# Altium schematic sheet BLOCK DIAGRAM.SchDoc
size A4; SheetNumber: 2; SheetTotal: 5
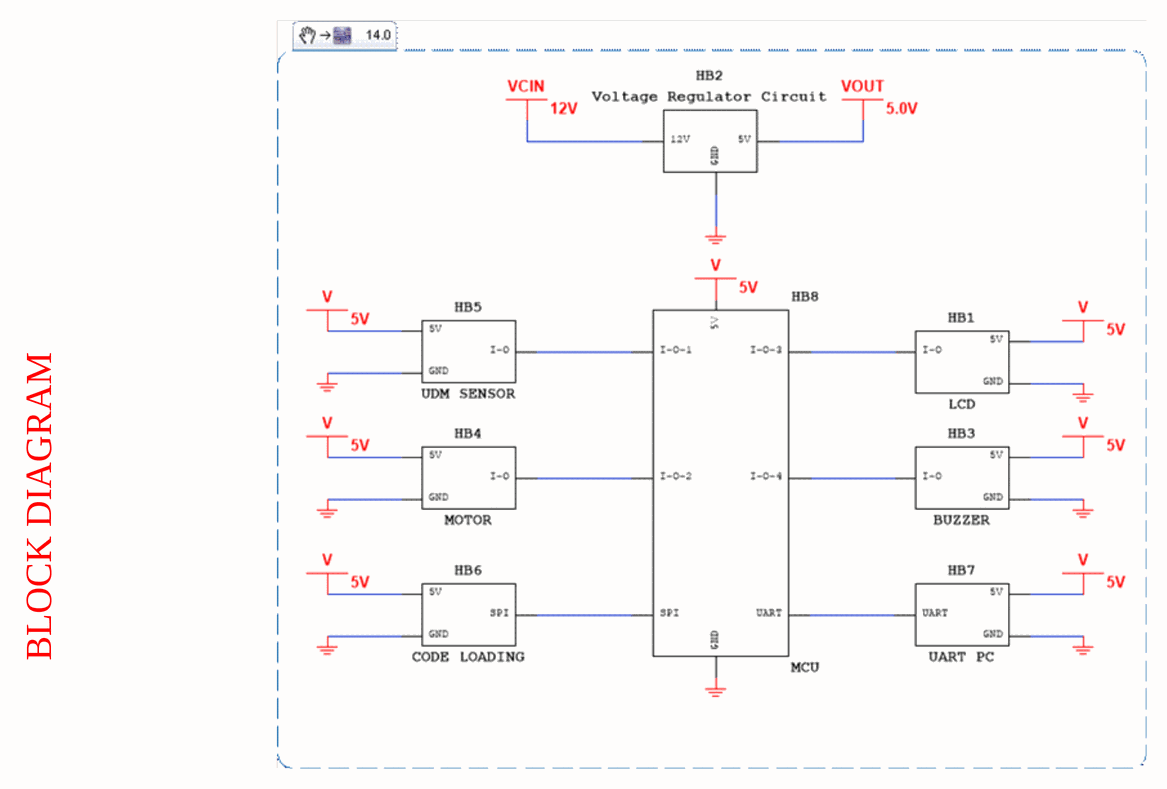
[diagram p0: BLOCK DIAGRAM.SchDoc]

## Notes on the sheet
- BLOCK DIAGRAM
- Project:
- Page Contents:
- Revision:
- Size:
- A4
- Document Number:
- Design:
- Group 2
- Date:
- Sheet
- of